# EAGLE design hand-unit (EAGLE 9.6.2)

## Sheet 1 of 2
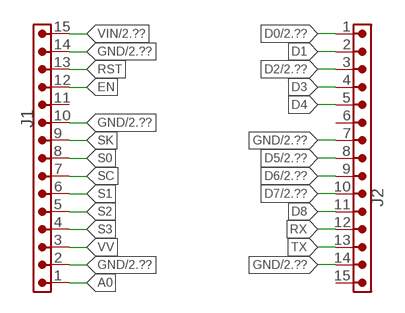
[diagram p0: schematic, sheet 1]

### Parts
J1  6130XX11121_61301511121  [61301511121]
J2  6130XX11121_61301511121  [61301511121]

### Nets
A0: J1.1
D0: J2.1 ; also sheet 2
D1: J2.2
D2: J2.3 ; also sheet 2
D3: J2.4
D4: J2.5
D5: J2.8 ; also sheet 2
D6: J2.9 ; also sheet 2
D7: J2.10 ; also sheet 2
D8: J2.11
EN: J1.12
GND: J1.2 J1.10 J1.14 J2.7 J2.14 ; also sheet 2
RST: J1.13
RX: J2.12
S0: J1.8
S1: J1.6
S2: J1.5
S3: J1.4
SC: J1.7
SK: J1.9
TX: J2.13
VIN: J1.15 ; also sheet 2
VV: J1.3
Unconnected: J1.11 J2.6 J2.15

## Sheet 2 of 2: Connections
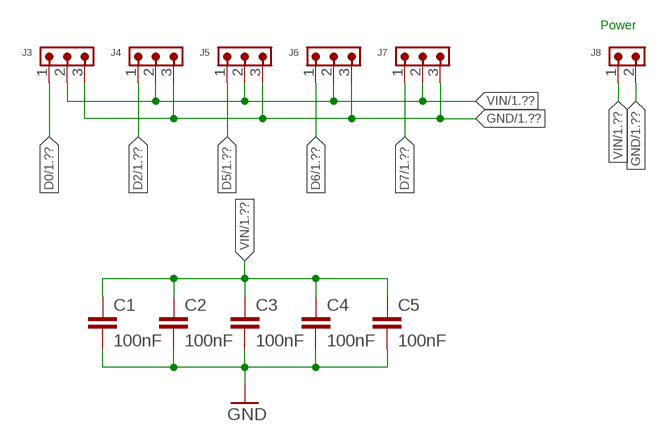
[diagram p1: schematic, sheet 2]

### Parts
C1  100nF  CC0603  [C0603]
C2  100nF  CC0603  [C0603]
C3  100nF  CC0603  [C0603]
C4  100nF  CC0603  [C0603]
C5  100nF  CC0603  [C0603]
J3  6130XX11121_61300311121  [61300311121]
J4  6130XX11121_61300311121  [61300311121]
J5  6130XX11121_61300311121  [61300311121]
J6  6130XX11121_61300311121  [61300311121]
J7  6130XX11121_61300311121  [61300311121]
J8  6130XX11121_61300211121  [61300211121]

### Nets
D0: J3.1 ; also sheet 1
D2: J4.1 ; also sheet 1
D5: J5.1 ; also sheet 1
D6: J6.1 ; also sheet 1
D7: J7.1 ; also sheet 1
GND: C1.2 C2.2 C3.2 C4.2 C5.2 J3.3 J4.3 J5.3 J6.3 J7.3 J8.2 ; also sheet 1
VIN: C1.1 C2.1 C3.1 C4.1 C5.1 J3.2 J4.2 J5.2 J6.2 J7.2 J8.1 ; also sheet 1

### Notes on the sheet
- Power

## Library data of the parts
C1-C5 = ACS - Basics:C: CAPACITOR, European symbol; SPICEMODEL: NONE; SPICEPREFIX: C
J1 J2 = Wurth_Connectors_WR-PHD:6130XX11121_61301511121: WR-PHD 2.54 mm THT Pin Header ARTICLE PROPERTIES: Pins:1;​ 2;​ 3;​ 4;​ 5;​ 6;​ 7;​ 8;​ 9;​ 10;​ 12;​ 13;​ 14;​ 15;​ 16;​ 18;​ 20;​ 22;​ 24;​ 25;​ 32;​ 36;​ 40 KIND PROPERTIES: Pitch：2.54 mm Quality Class:3 as per CECC 75 301-802 Rows：Single Gender：Pin Header Type：Straight MATERIAL PROPERTIES: Insulator Material :PBT Insulator Flammability Rating:UL94 V-0 Contact Material:Copper Alloy Contact Plating:Gold Contact Type:Stamped GENERAL INFORMATION Operating Temperature:-40 up to +105 °C Compliance:RoHS ELECTRICAL PROPERTIES: Rated Current:3 A IR 1:3 A Withstanding Voltage:500 V (AC) Contact Resistance:20 mΩ RISO:1000 MΩ CERTIFICATION UL Approval:E323964 PACKAGING PROPERTIES Packaging:Bag <https://katalog.we-online.com/media/images/v2/o33211v209%20Family_BTB_PHD_6130xx11121.jpg> Details see: https://katalog.we-online.com/en/em/PHD_2_54_THT_PIN_HEADER_6130XX11121 Updated by Yingchun,Shan 2019-10-16 2019 (C) Würth Elektronik; DATASHEET-URL: https://katalog.we-online.com/em/datasheet/61301511121.pdf; GENDER: Pin Header; IR: 3A; MATES: WR-PHD 2.54mm Angled Socket Header /SMT Socket Header/Socket Header; PACKAGING: Bag; PART-NUMBER: 61301511121; PINS: 15; ROWS: Single; TYPE: Straight
J3-J7 = Wurth_Connectors_WR-PHD:6130XX11121_61300311121: WR-PHD 2.54 mm THT Pin Header ARTICLE PROPERTIES: Pins:1;​ 2;​ 3;​ 4;​ 5;​ 6;​ 7;​ 8;​ 9;​ 10;​ 12;​ 13;​ 14;​ 15;​ 16;​ 18;​ 20;​ 22;​ 24;​ 25;​ 32;​ 36;​ 40 KIND PROPERTIES: Pitch：2.54 mm Quality Class:3 as per CECC 75 301-802 Rows：Single Gender：Pin Header Type：Straight MATERIAL PROPERTIES: Insulator Material :PBT Insulator Flammability Rating:UL94 V-0 Contact Material:Copper Alloy Contact Plating:Gold Contact Type:Stamped GENERAL INFORMATION Operating Temperature:-40 up to +105 °C Compliance:RoHS ELECTRICAL PROPERTIES: Rated Current:3 A IR 1:3 A Withstanding Voltage:500 V (AC) Contact Resistance:20 mΩ RISO:1000 MΩ CERTIFICATION UL Approval:E323964 PACKAGING PROPERTIES Packaging:Bag <https://katalog.we-online.com/media/images/v2/o33211v209%20Family_BTB_PHD_6130xx11121.jpg> Details see: https://katalog.we-online.com/en/em/PHD_2_54_THT_PIN_HEADER_6130XX11121 Updated by Yingchun,Shan 2019-10-16 2019 (C) Würth Elektronik; DATASHEET-URL: https://katalog.we-online.com/em/datasheet/61300311121.pdf; GENDER: Pin Header; IR: 3A; MATES: WR-PHD 2.54mm Angled Socket Header /SMT Socket Header/Socket Header; PACKAGING: Bag; PART-NUMBER: 61300311121; PINS: 3; ROWS: Single; TYPE: Straight
J8 = Wurth_Connectors_WR-PHD:6130XX11121_61300211121: WR-PHD 2.54 mm THT Pin Header ARTICLE PROPERTIES: Pins:1;​ 2;​ 3;​ 4;​ 5;​ 6;​ 7;​ 8;​ 9;​ 10;​ 12;​ 13;​ 14;​ 15;​ 16;​ 18;​ 20;​ 22;​ 24;​ 25;​ 32;​ 36;​ 40 KIND PROPERTIES: Pitch：2.54 mm Quality Class:3 as per CECC 75 301-802 Rows：Single Gender：Pin Header Type：Straight MATERIAL PROPERTIES: Insulator Material :PBT Insulator Flammability Rating:UL94 V-0 Contact Material:Copper Alloy Contact Plating:Gold Contact Type:Stamped GENERAL INFORMATION Operating Temperature:-40 up to +105 °C Compliance:RoHS ELECTRICAL PROPERTIES: Rated Current:3 A IR 1:3 A Withstanding Voltage:500 V (AC) Contact Resistance:20 mΩ RISO:1000 MΩ CERTIFICATION UL Approval:E323964 PACKAGING PROPERTIES Packaging:Bag <https://katalog.we-online.com/media/images/v2/o33211v209%20Family_BTB_PHD_6130xx11121.jpg> Details see: https://katalog.we-online.com/en/em/PHD_2_54_THT_PIN_HEADER_6130XX11121 Updated by Yingchun,Shan 2019-10-16 2019 (C) Würth Elektronik; DATASHEET-URL: https://katalog.we-online.com/em/datasheet/61300211121.pdf; GENDER: Pin Header; IR: 3A; MATES: WR-PHD 2.54mm Angled Socket Header /SMT Socket Header/Socket Header; PACKAGING: Bag; PART-NUMBER: 61300211121; PINS: 2; ROWS: Single; TYPE: Straight

## Board
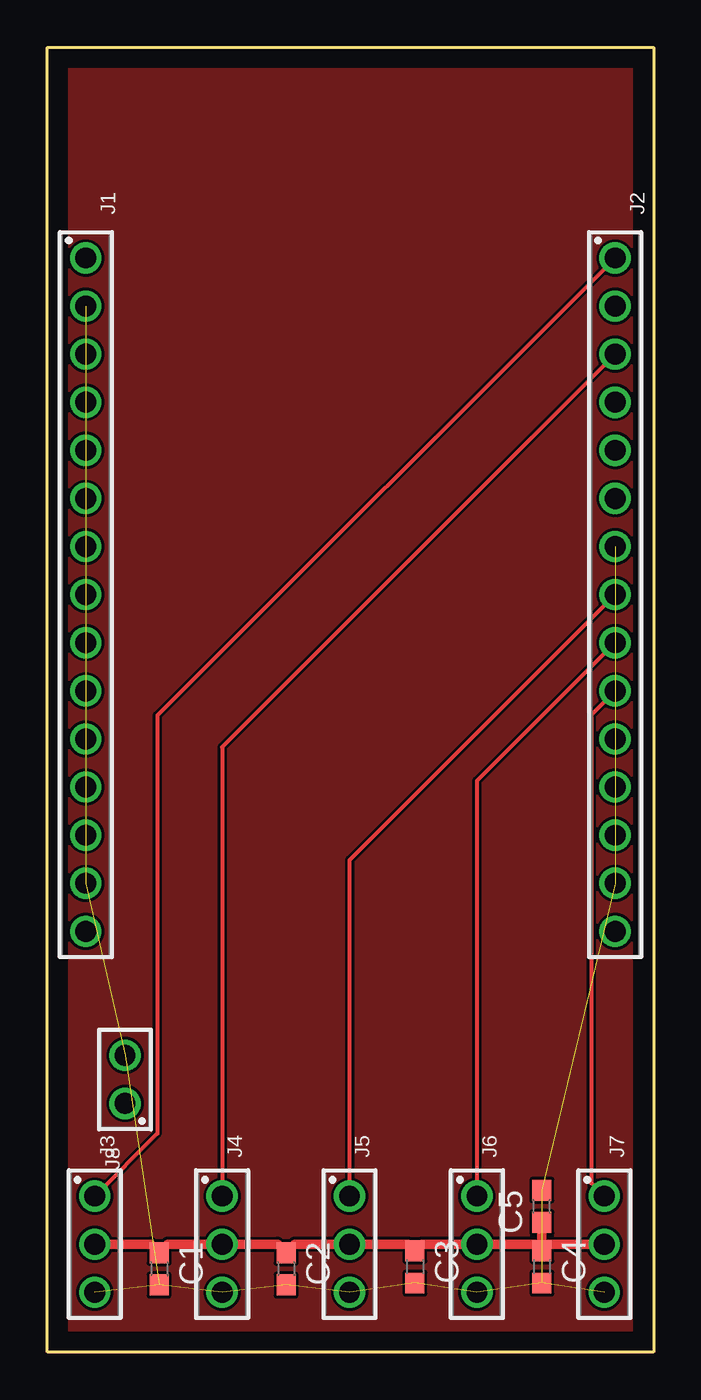
[diagram p2: board, top side]
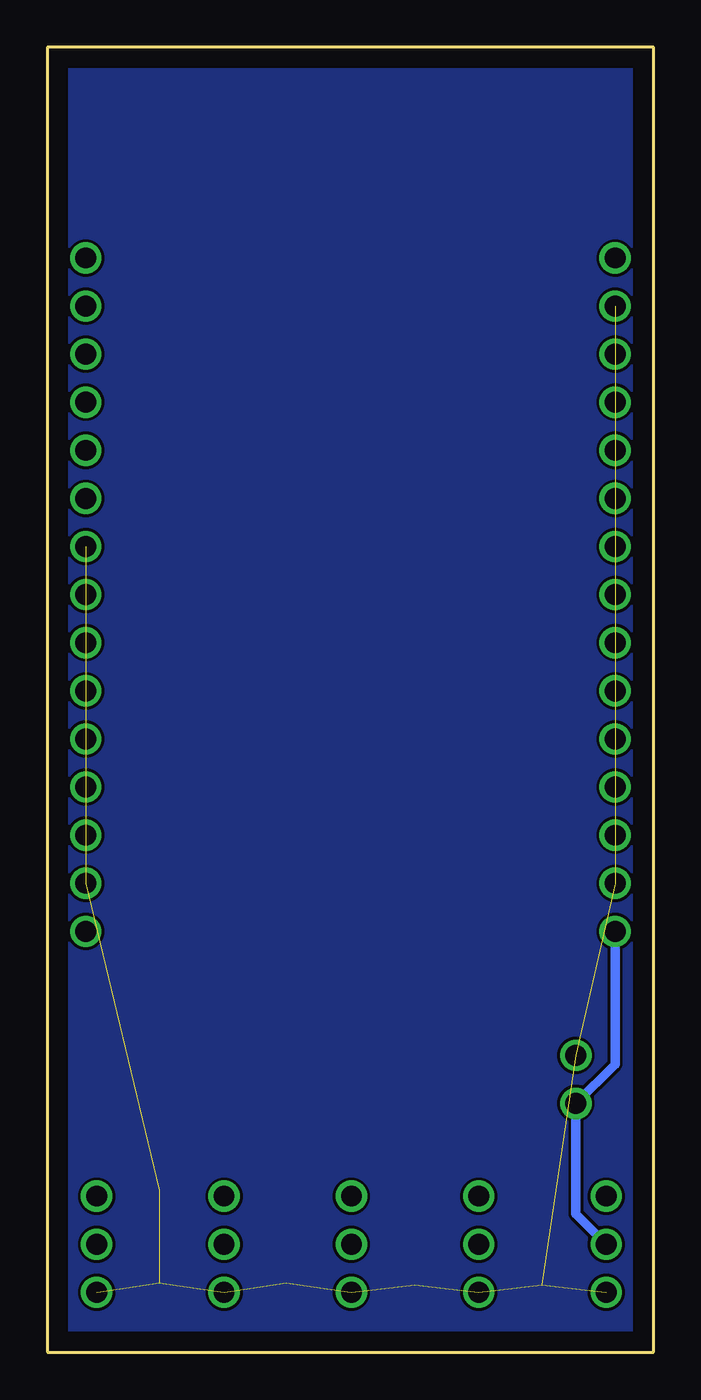
[diagram p3: board, bottom side, seen from below]

Size 32 x 68.9 mm. Coordinates in mm from the lower left corner, seen from the top.
Outline: 0,0 0,68.9 32,68.9 32,0 0,0
Copper layers (1*16): Top 0.035mm / dielectric 0.15mm / Bottom 0.035mm
Design rules "default": minimum track width 6mil, minimum drill 0.35mm, track to track 6mil, track to pad 6mil, pad to pad 6mil, via to via 6mil, smd to smd 6mil, copper to edge 40mil, drill to drill 6mil, minimum pad ring 10mil, minimum via ring 8mil, stop-mask expansion 4mil, vias tented up to drill 0mil, thermal gap 10mil

### Footprints (pad centres in the part's own frame; a part is rotated, then mirrored left to right if it is on the bottom)
C0603 = smd 1.1 x 1: 1 -0.85,0; 2 0.85,0
61301511121 = drill 1.1: 1 -17.78,0; 2 -15.24,0; 3 -12.7,0; 4 -10.16,0; 5 -7.62,0; 6 -5.08,0; 7 -2.54,0; 8 0,0; 9 2.54,0; 10 5.08,0; 11 7.62,0; 12 10.16,0; 13 12.7,0; 14 15.24,0; 15 17.78,0
61300311121 = drill 1.1: 1 -2.54,0; 2 0,0; 3 2.54,0
61300211121 = drill 1.1: 1 -1.27,0; 2 1.27,0

### Placement (x,y rotation side)
C1  5.9,4.4 270 top
C2  12.6,4.4 270 top
C3  19.4,4.5 270 top
C4  26.1,4.5 270 top
C5  26.1,7.7 90 top
J1  2.03,40 270 top
J2  29.97,40 270 top
J3  2.5,5.7 270 top
J4  9.22,5.7 270 top
J5  15.95,5.7 270 top
J6  22.68,5.7 270 top
J7  29.4,5.7 270 top
J8  4.1,14.4 90 top

### Tracks (layer width: path | path; a pad name or v marks a point on that pad's centre or on a via)
D0
  Top 0.2: J2.1 5.81,33.62 5.81,11.55 J3.1
D2
  Top 0.2: J2.3 9.22,31.95 J4.1
D5
  Top 0.2: J5.1 15.95,25.98 J2.8
D6
  Top 0.2: J2.9 22.68,30.16 J6.1
D7
  Top 0.2: J7.1 28.7,8.94 28.7,33.65 J2.10
GND  (15 unrouted)
GND1
  pour Top: -0.26,69.25 -0.26,-0.87 32.36,-0.87 32.36,69.25
  pour Bottom: -0.55,69.54 -0.55,-0.53 32.65,-0.53 32.65,69.54
VIN
  Top 0.5: C5.1 C4.1 | C4.1 26.45,5.7 J7.2 | C4.1 25.75,5.7 J6.2 19.75,5.7 C3.1 19.05,5.7 J5.2 13.05,5.7 C2.1 12.15,5.7 J4.2 6.35,5.7 C1.1 5.45,5.7 J3.2
  Bottom 0.5: J3.2 4.1,7.3 J8.1 2.03,15.2 J1.15